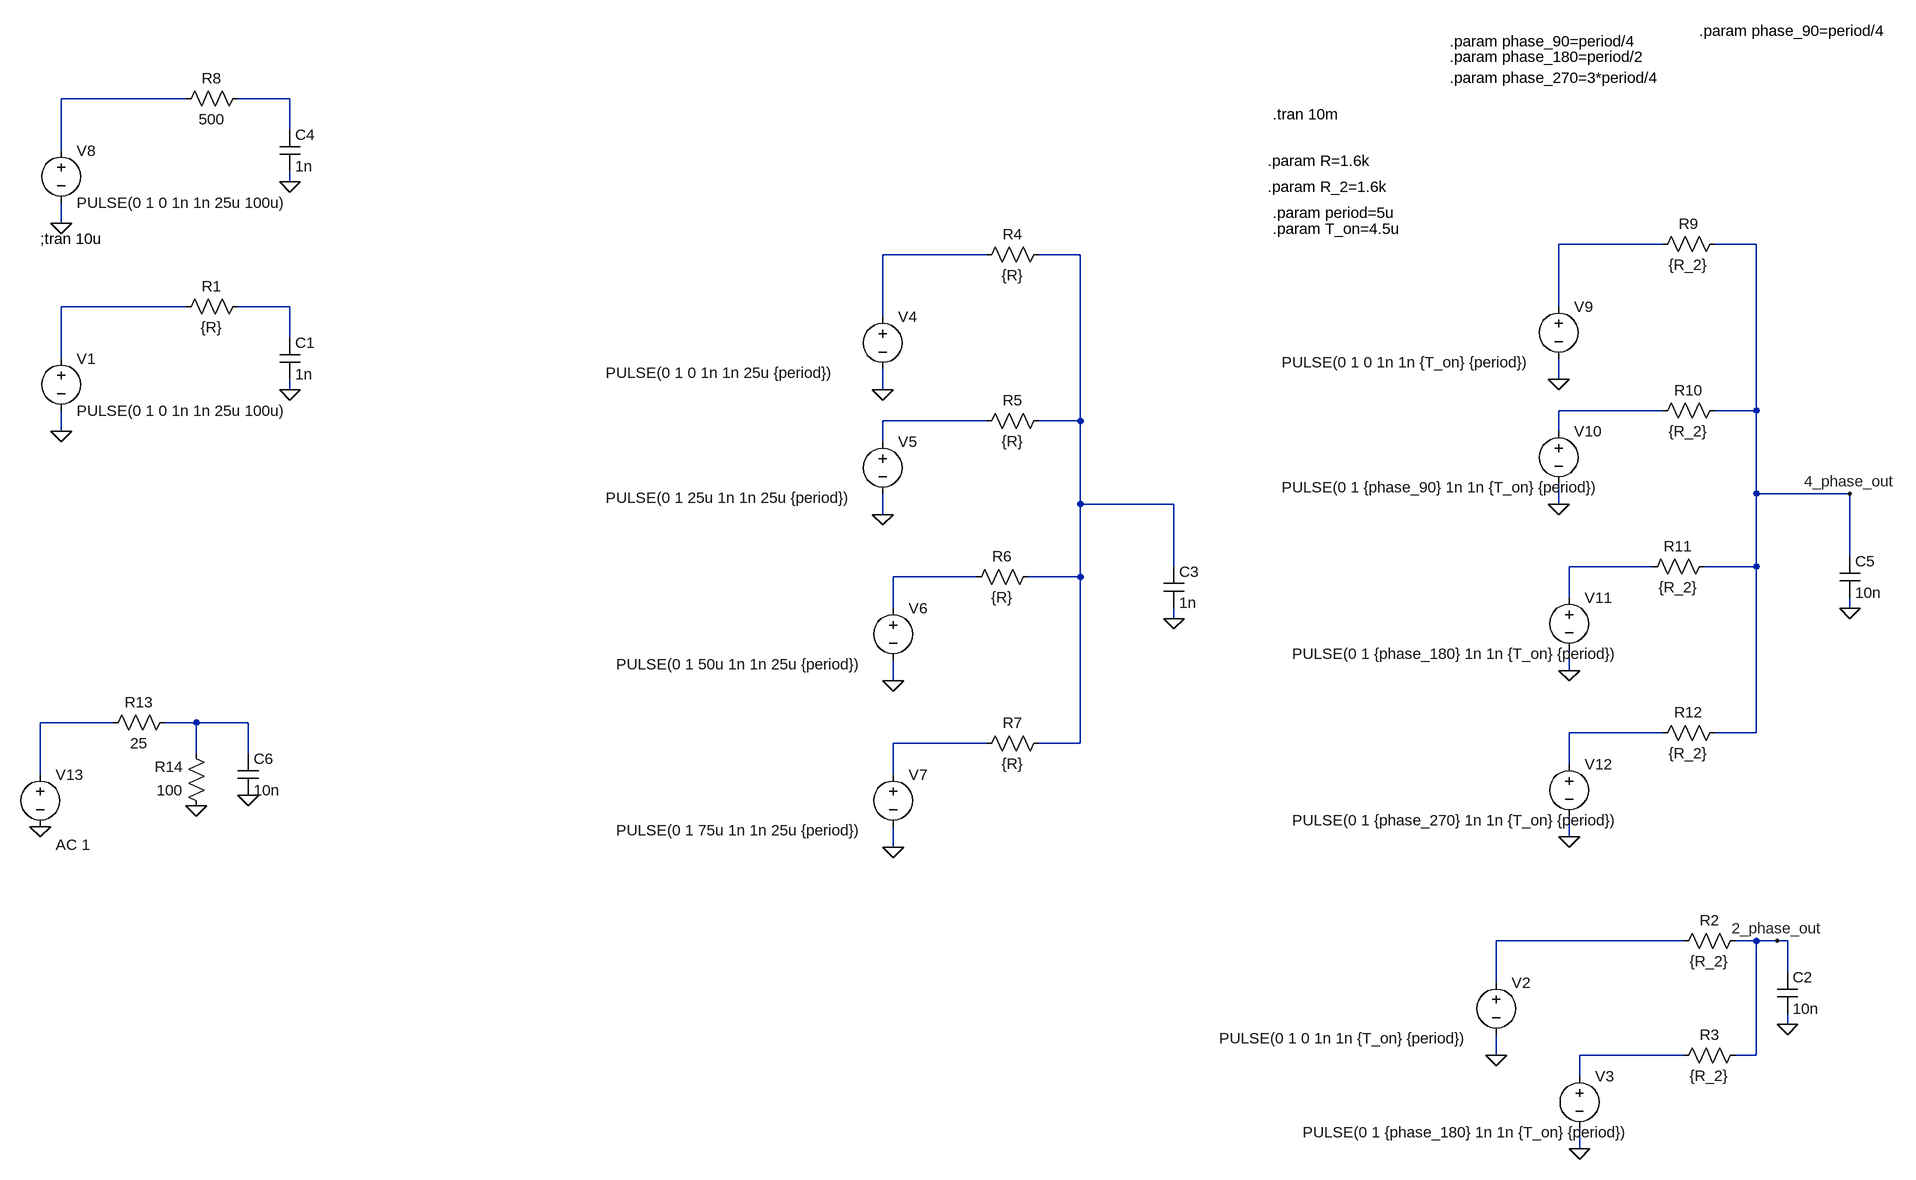
[diagram p0: schematic Phase_PWM.asc]
Phase_PWM.asc, the LTspice schematic file:
Version 4
SHEET 1 3132 1396
WIRE 288 -240 96 -240
WIRE 448 -240 368 -240
WIRE 448 -192 448 -240
WIRE 96 -160 96 -240
WIRE 448 -112 448 -128
WIRE 96 -48 96 -80
WIRE 2560 -16 2400 -16
WIRE 2704 -16 2640 -16
WIRE 1520 0 1360 0
WIRE 1664 0 1600 0
WIRE 288 80 96 80
WIRE 448 80 368 80
WIRE 2400 80 2400 -16
WIRE 1360 96 1360 0
WIRE 448 128 448 80
WIRE 96 160 96 80
WIRE 2400 192 2400 160
WIRE 448 208 448 192
WIRE 1360 208 1360 176
WIRE 2560 240 2400 240
WIRE 2704 240 2704 -16
WIRE 2704 240 2640 240
WIRE 1520 256 1360 256
WIRE 1664 256 1664 0
WIRE 1664 256 1600 256
WIRE 96 272 96 240
WIRE 2400 272 2400 240
WIRE 1360 288 1360 256
WIRE 2704 368 2704 240
WIRE 2848 368 2704 368
WIRE 1664 384 1664 256
WIRE 1808 384 1664 384
WIRE 2400 384 2400 352
WIRE 1360 400 1360 368
WIRE 2848 464 2848 368
WIRE 1808 480 1808 384
WIRE 2544 480 2416 480
WIRE 2704 480 2704 368
WIRE 2704 480 2624 480
WIRE 1504 496 1376 496
WIRE 1664 496 1664 384
WIRE 1664 496 1584 496
WIRE 2416 528 2416 480
WIRE 1376 544 1376 496
WIRE 2848 544 2848 528
WIRE 1808 560 1808 544
WIRE 2416 640 2416 608
WIRE 1376 656 1376 624
WIRE 176 720 64 720
WIRE 304 720 256 720
WIRE 384 720 304 720
WIRE 2560 736 2416 736
WIRE 2704 736 2704 480
WIRE 2704 736 2640 736
WIRE 1520 752 1376 752
WIRE 1664 752 1664 496
WIRE 1664 752 1600 752
WIRE 304 768 304 720
WIRE 384 768 384 720
WIRE 2416 784 2416 736
WIRE 64 800 64 720
WIRE 1376 800 1376 752
WIRE 2416 896 2416 864
WIRE 1376 912 1376 880
WIRE 2592 1056 2304 1056
WIRE 2704 1056 2672 1056
WIRE 2736 1056 2704 1056
WIRE 2752 1056 2736 1056
WIRE 2752 1104 2752 1056
WIRE 2304 1120 2304 1056
WIRE 2752 1184 2752 1168
WIRE 2304 1232 2304 1200
WIRE 2592 1232 2432 1232
WIRE 2704 1232 2704 1056
WIRE 2704 1232 2672 1232
WIRE 2432 1264 2432 1232
WIRE 2432 1376 2432 1344
FLAG 96 272 0
FLAG 448 208 0
FLAG 2304 1232 0
FLAG 2752 1184 0
FLAG 2432 1376 0
FLAG 1360 208 0
FLAG 1808 560 0
FLAG 1360 400 0
FLAG 1376 656 0
FLAG 1376 912 0
FLAG 96 -48 0
FLAG 448 -112 0
FLAG 2400 192 0
FLAG 2848 544 0
FLAG 2400 384 0
FLAG 2416 640 0
FLAG 2416 896 0
FLAG 2848 368 4_phase_out
FLAG 2736 1056 2_phase_out
FLAG 304 848 0
FLAG 384 832 0
FLAG 64 880 0
SYMBOL voltage 96 144 R0
WINDOW 123 0 0 Left 0
WINDOW 39 0 0 Left 0
SYMATTR InstName V1
SYMATTR Value PULSE(0 1 0 1n 1n 25u 100u)
SYMBOL cap 432 128 R0
SYMATTR InstName C1
SYMATTR Value 1n
SYMBOL voltage 2304 1104 R0
WINDOW 3 -426 102 Left 2
WINDOW 123 0 0 Left 0
WINDOW 39 0 0 Left 0
SYMATTR Value PULSE(0 1 0 1n 1n {T_on} {period})
SYMATTR InstName V2
SYMBOL res 2688 1040 R90
WINDOW 0 0 56 VBottom 2
WINDOW 3 32 56 VTop 2
SYMATTR InstName R2
SYMATTR Value {R_2}
SYMBOL cap 2736 1104 R0
SYMATTR InstName C2
SYMATTR Value 10n
SYMBOL voltage 2432 1248 R0
WINDOW 3 -426 102 Left 2
WINDOW 123 0 0 Left 0
WINDOW 39 0 0 Left 0
SYMATTR Value PULSE(0 1 {phase_180} 1n 1n {T_on} {period})
SYMATTR InstName V3
SYMBOL voltage 1360 80 R0
WINDOW 3 -426 102 Left 2
WINDOW 123 0 0 Left 0
WINDOW 39 0 0 Left 0
SYMATTR Value PULSE(0 1 0 1n 1n 25u {period})
SYMATTR InstName V4
SYMBOL cap 1792 480 R0
SYMATTR InstName C3
SYMATTR Value 1n
SYMBOL voltage 1360 272 R0
WINDOW 3 -426 102 Left 2
WINDOW 123 0 0 Left 0
WINDOW 39 0 0 Left 0
SYMATTR Value PULSE(0 1 25u 1n 1n 25u {period})
SYMATTR InstName V5
SYMBOL voltage 1376 528 R0
WINDOW 3 -426 102 Left 2
WINDOW 123 0 0 Left 0
WINDOW 39 0 0 Left 0
SYMATTR Value PULSE(0 1 50u 1n 1n 25u {period})
SYMATTR InstName V6
SYMBOL voltage 1376 784 R0
WINDOW 3 -426 102 Left 2
WINDOW 123 0 0 Left 0
WINDOW 39 0 0 Left 0
SYMATTR Value PULSE(0 1 75u 1n 1n 25u {period})
SYMATTR InstName V7
SYMBOL voltage 96 -176 R0
WINDOW 123 0 0 Left 0
WINDOW 39 0 0 Left 0
SYMATTR InstName V8
SYMATTR Value PULSE(0 1 0 1n 1n 25u 100u)
SYMBOL res 384 -256 R90
WINDOW 0 0 56 VBottom 2
WINDOW 3 32 56 VTop 2
SYMATTR InstName R8
SYMATTR Value 500
SYMBOL cap 432 -192 R0
SYMATTR InstName C4
SYMATTR Value 1n
SYMBOL res 2688 1216 R90
WINDOW 0 0 56 VBottom 2
WINDOW 3 32 56 VTop 2
SYMATTR InstName R3
SYMATTR Value {R_2}
SYMBOL res 1616 -16 R90
WINDOW 0 0 56 VBottom 2
WINDOW 3 32 56 VTop 2
SYMATTR InstName R4
SYMATTR Value {R}
SYMBOL res 1616 240 R90
WINDOW 0 0 56 VBottom 2
WINDOW 3 32 56 VTop 2
SYMATTR InstName R5
SYMATTR Value {R}
SYMBOL res 1600 480 R90
WINDOW 0 0 56 VBottom 2
WINDOW 3 32 56 VTop 2
SYMATTR InstName R6
SYMATTR Value {R}
SYMBOL res 1616 736 R90
WINDOW 0 0 56 VBottom 2
WINDOW 3 32 56 VTop 2
SYMATTR InstName R7
SYMATTR Value {R}
SYMBOL res 384 64 R90
WINDOW 0 0 56 VBottom 2
WINDOW 3 32 56 VTop 2
SYMATTR InstName R1
SYMATTR Value {R}
SYMBOL voltage 2400 64 R0
WINDOW 3 -426 102 Left 2
WINDOW 123 0 0 Left 0
WINDOW 39 0 0 Left 0
SYMATTR Value PULSE(0 1 0 1n 1n {T_on} {period})
SYMATTR InstName V9
SYMBOL cap 2832 464 R0
SYMATTR InstName C5
SYMATTR Value 10n
SYMBOL voltage 2400 256 R0
WINDOW 3 -426 102 Left 2
WINDOW 123 0 0 Left 0
WINDOW 39 0 0 Left 0
SYMATTR Value PULSE(0 1 {phase_90} 1n 1n {T_on} {period})
SYMATTR InstName V10
SYMBOL voltage 2416 512 R0
WINDOW 3 -426 102 Left 2
WINDOW 123 0 0 Left 0
WINDOW 39 0 0 Left 0
SYMATTR Value PULSE(0 1 {phase_180} 1n 1n {T_on} {period})
SYMATTR InstName V11
SYMBOL voltage 2416 768 R0
WINDOW 3 -426 102 Left 2
WINDOW 123 0 0 Left 0
WINDOW 39 0 0 Left 0
SYMATTR Value PULSE(0 1 {phase_270} 1n 1n {T_on} {period})
SYMATTR InstName V12
SYMBOL res 2656 -32 R90
WINDOW 0 0 56 VBottom 2
WINDOW 3 32 56 VTop 2
SYMATTR InstName R9
SYMATTR Value {R_2}
SYMBOL res 2656 224 R90
WINDOW 0 0 56 VBottom 2
WINDOW 3 32 56 VTop 2
SYMATTR InstName R10
SYMATTR Value {R_2}
SYMBOL res 2640 464 R90
WINDOW 0 0 56 VBottom 2
WINDOW 3 32 56 VTop 2
SYMATTR InstName R11
SYMATTR Value {R_2}
SYMBOL res 2656 720 R90
WINDOW 0 0 56 VBottom 2
WINDOW 3 32 56 VTop 2
SYMATTR InstName R12
SYMATTR Value {R_2}
SYMBOL res 272 704 R90
WINDOW 0 0 56 VBottom 2
WINDOW 3 32 56 VTop 2
SYMATTR InstName R13
SYMATTR Value 25
SYMBOL res 320 864 R180
WINDOW 0 36 76 Left 2
WINDOW 3 36 40 Left 2
SYMATTR InstName R14
SYMATTR Value 100
SYMBOL cap 368 768 R0
SYMATTR InstName C6
SYMATTR Value 10n
SYMBOL voltage 64 784 R0
WINDOW 123 24 124 Left 2
WINDOW 39 0 0 Left 0
SYMATTR InstName V13
SYMATTR Value ""
SYMATTR Value2 AC 1
TEXT 64 -24 Left 2 !;tran 10u
TEXT 1960 -216 Left 2 !.tran 10m
TEXT 1952 -144 Left 2 !.param R=1.6k
TEXT 1952 -104 Left 2 !.param R_2=1.6k
TEXT 1960 -64 Left 2 !.param period=5u
TEXT 1960 -40 Left 2 !.param T_on=4.5u
TEXT 2232 -304 Left 2 !.param phase_180=period/2
TEXT 2232 -328 Left 2 !.param phase_90=period/4
TEXT 2232 -272 Left 2 !.param phase_270=3*period/4
TEXT 2616 -344 Left 2 !.param phase_90=period/4

The netlist it stands for:
* Phase_PWM.asc
V1 N006 0 PULSE(0 1 0 1n 1n 25u 100u)
C1 N007 0 1n
V2 N016 0 PULSE(0 1 0 1n 1n {T_on} {period})
R2 2_phase_out N016 {R_2}
C2 2_phase_out 0 10n
V3 N017 0 PULSE(0 1 {phase_180} 1n 1n {T_on} {period})
V4 N004 0 PULSE(0 1 0 1n 1n 25u {period})
C3 N005 0 1n
V5 N009 0 PULSE(0 1 25u 1n 1n 25u {period})
V6 N011 0 PULSE(0 1 50u 1n 1n 25u {period})
V7 N015 0 PULSE(0 1 75u 1n 1n 25u {period})
V8 N001 0 PULSE(0 1 0 1n 1n 25u 100u)
R8 N002 N001 500
C4 N002 0 1n
R3 2_phase_out N017 {R_2}
R4 N005 N004 {R}
R5 N005 N009 {R}
R6 N005 N011 {R}
R7 N005 N015 {R}
R1 N007 N006 {R}
V9 N003 0 PULSE(0 1 0 1n 1n {T_on} {period})
C5 4_phase_out 0 10n
V10 N008 0 PULSE(0 1 {phase_90} 1n 1n {T_on} {period})
V11 N010 0 PULSE(0 1 {phase_180} 1n 1n {T_on} {period})
V12 N014 0 PULSE(0 1 {phase_270} 1n 1n {T_on} {period})
R9 4_phase_out N003 {R_2}
R10 4_phase_out N008 {R_2}
R11 4_phase_out N010 {R_2}
R12 4_phase_out N014 {R_2}
R13 N013 N012 25
R14 0 N013 100
C6 N013 0 10n
V13 N012 0 AC 1
;tran 10u
.tran 10m
.param R=1.6k
.param R_2=1.6k
.param period=5u
.param T_on=4.5u
.param phase_180=period/2
.param phase_90=period/4
.param phase_270=3*period/4
.param phase_90=period/4
.backanno
.end